# Altium project USB-SMB-ISO-CP2112.PrjPcb (part 1 of 2)
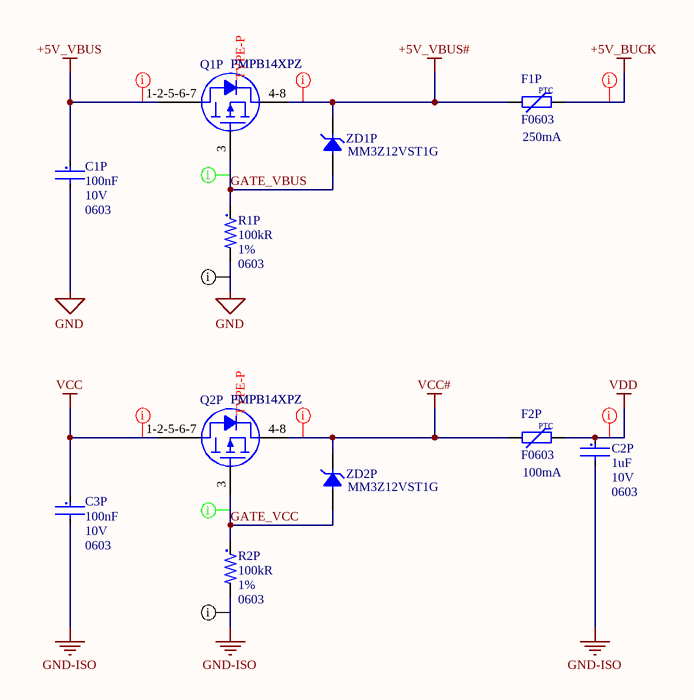
[diagram p0: 1_Power_Path.SchDoc]
6 sheets, 48 parts. Net scope: flat (ports and power ports of the same name join across sheets).
Board file: USB-SMB-ISO-CP2112-V-1.PcbDoc
Sheets:
  1_Power_Path.SchDoc
  2_LDO.SchDoc
  3_USB_TO_UART.SchDoc
  4_Digital_Isolator.SchDoc
  6_Connector.SchDoc
  7_MountingHoles.SchDoc

## Sheet 1_Power_Path.SchDoc: Power_Path
size A4; ApprovedBy: Alcatraz; CheckedBy: Alcatraz; Author: Alcatraz; CompanyName: DHNLAB; DrawnBy: Alcatraz; Engineer: Alcatraz; Organization: DHNLAB PVT LTD; Address1: DHANBAD; Address2: JHARKHAND; Address3: INDIA; Address4: ASIA; DocumentNumber: 1; Revision: 1.0; SheetNumber: 1; SheetTotal: 6; ProjectTitle: USB-SMB-ISO-CP2112

### Parts
C1P  value 100nF  Voltage: 10V  Case/Package: 0603  [C0603-IPC_C_No_Silk]  (hidden comment: C0603C104K8RACTU)
C2P  value 1uF  Voltage Rating: 10V  Case Code (Imperial): 0603  [C0603-IPC_C_No_Silk]  (hidden comment: C0603C105K8PACTU)
C3P  value 100nF  Voltage: 10V  Case/Package: 0603  [C0603-IPC_C_No_Silk]  (hidden comment: C0603C104K8RACTU)
F1P  F0603  value 250mA  [R0603-MFG]
F2P  F0603  value 100mA  [R0603-MFG]
Q1P  PMPB14XPZ  [DFN2020MD-MFG]
Q2P  PMPB14XPZ  [DFN2020MD-MFG]
R1P  value 100kR  Tolerance: 1%  Case/Package: 0603  [R0603-MFG]  (hidden comment: AC0603FR-07100KL)
R2P  value 100kR  Tolerance: 1%  Case/Package: 0603  [R0603-MFG]  (hidden comment: AC0603FR-07100KL)
ZD1P  MM3Z12VST1G  [SOD-323]
ZD2P  MM3Z12VST1G  [SOD-323]

### Nets
+5V_BUCK: F1P.2
+5V_VBUS: C1P.1 Q1P.1-2-5-6-7(D)
+5V_VBUS#: F1P.1 Q1P.4-8(S) ZD1P.1(C)
GND: C1P.2 R1P.2
GND-ISO: C2P.2 C3P.2 R2P.2
VCC: C3P.1 Q2P.1-2-5-6-7(D)
VCC#: F2P.1 Q2P.4-8(S) ZD2P.1(C)
VDD: C2P.1 F2P.2
GATE_VBUS: Q1P.3(G) R1P.1 ZD1P.2(A)
GATE_VCC: Q2P.3(G) R2P.1 ZD2P.2(A)

### Layout directives
net class Power; net class PowerRails_LowVoltage_DC: +5V_BUCK, +5V_VBUS, +5V_VBUS#, VCC, VCC#, VDD
net class GND; net class PowerRails_GND: GND, GND-ISO
net class Digital_Signal_Low_Speed; net class Signal: GATE_VBUS, GATE_VCC

### Notes on the sheet
- Title:
- Author:
- Approved:
- Size:
- Date:
- Git Hash:
- A4
- Prj:
- SW Version:
- Variant:
- Edited:
- PUBLIC
- File:
- (in symbol FUSE_PPTC_0603) PTC
- (in symbol PMPB14XPZ) TYPE-P

### Library data of the parts
C1P C3P = 100nF_10V: Multilayer Ceramic Capacitor, 0.1 uF, 10 V, ± 10%, X7R, 0603 [1608 Metric]; Manufacturer: KEMET; Material: 4241ConductorMaterial; Dissipation Factor: 5%; Temperature Coefficient: 30ppm/°C; Manufacturer Part Number: C0603C104K8RACTU; Supplier 1: Mouser; Category: Ceramic Capacitors; Stock 1: 246409; Pricing 1: 1=0.11, 10=0.075, 50=0.075, 100=0.036, 1000=0.021, 10000=0.017 (USD); Supplier Part Number 1: 80-C0603C104K8R; RoHS: Yes; Mounting Technology: Surface Mount,PCB; Pins: 2; Case Code (Imperial): 0603; Case Code (Metric): 1608; Dielectric Material: Ceramic; Min Operating Temperature: -55°C; Max Operating Temperature: 125°C; Tolerance: 10%; Voltage Rating: 10V; Packaging: Tape and Reel; Dielectric: X7R; Series: C; Package Quantity: 1; Termination: SMD/SMT; Construction: Flat; Length: 1.6mm; Width: 0.031inch; Height: 0.8mm; Thickness: 0.034inch; Lead Pitch: 0.7mm; Depth: 0.8mm; Radiation Hardening: No; Reach SVHC Compliant: No; RoHS Compliant: Yes; Lead Free: 5697LeadFree; ComponentLink1URL: https://datasheet.ciiva.com/6093/1776114-6093269.pdf?src-supplier=Farnell; ComponentLink1Description: https://datasheet.ciiva.com/6093/1776114-6093269.pdf?src-supplier=Farnell; ComponentLink2URL: https://datasheet.ciiva.com/7823/kem-c1002-x7r-smd-7823989.pdf?src-supplier=Element14; ComponentLink2Description: https://datasheet.ciiva.com/7823/kem-c1002-x7r-smd-7823989.pdf?src-supplier=Element14; ComponentLink3URL: https://datasheet.ciiva.com/22693/1851736-22693967.pdf?src-supplier=Element14; ComponentLink3Description: https://datasheet.ciiva.com/22693/1851736-22693967.pdf?src-supplier=Element14; ComponentLink4URL: https://datasheet.ciiva.com/14589/70095383-14589402.pdf?src-supplier=Allied+Electronics; ComponentLink4Description: https://datasheet.ciiva.com/14589/70095383-14589402.pdf?src-supplier=Allied+Electronics; ComponentLink5URL: https://datasheet.ciiva.com/14593/70095383-14593978.pdf?src-supplier=Allied+Electronics; ComponentLink5Description: https://datasheet.ciiva.com/14593/70095383-14593978.pdf?src-supplier=Allied+Electronics; ComponentLink6URL: https://datasheet.ciiva.com/5419/kem-c1002-x7r-smd-357932-5419657.pdf?src-supplier=Mouser; ComponentLink6Description: https://datasheet.ciiva.com/5419/kem-c1002-x7r-smd-357932-5419657.pdf?src-supplier=Mouser; ComponentLink7URL: https://datasheet.ciiva.com/18192/getdatasheetpartid-91529-18192711.pdf?src-supplier=Verical; ComponentLink7Description: https://datasheet.ciiva.com/18192/getdatasheetpartid-91529-18192711.pdf?src-supplier=Verical; Voltage Rating (DC): 10V
C2P = 1uF_10V: Ceramic Capacitor, Multilayer, Ceramic, 10V, 10% +Tol, 10% -Tol, X5R, 15% TC, 1uF, 0603; Manufacturer: KEMET; Supplier 1: Mouser; Manufacturer Part Number: C0603C105K8PACTU; RoHS: Yes; Category: Ceramic Capacitors; Stock 1: 221942; Pricing 1: 1=0.1, 10=0.03, 50=0.03, 100=0.018, 1000=0.014, 10000=0.009 (USD); Mounting Technology: Surface Mount; Case/Package: 0603; Pins: 2; Case Code (Metric): 1608; Dielectric Material: Ceramic; Weight: 7.1E-05oz; Min Operating Temperature: -55°C; Max Operating Temperature: 85°C; Tolerance: 10%; Packaging: Tape and Reel; Dielectric: X5R; Termination: SMD/SMT; Package Quantity: 1; Series: C; Construction: Flat; Voltage Rating (DC): 10V; Voltage: 10V; Length: 1.6mm; Width: 0.031inch; Height: 0.8mm; Depth: 0.8mm; Thickness: 0.035inch; Radiation Hardening: No; RoHS Compliant: Yes; Reach SVHC Compliant: No; Lead Free: 5697LeadFree
F1P F2P = FUSE_PPTC_0603: Fuse PPTC SMD 0603; Manufacturer: *; Manufacturer Part Number: *
Q1P Q2P = PMPB14XPZ: Manufacturer: Nexperia; Supplier 1: Element14; Supplier Part Number 1: 4177131; Manufacturer Part Number: PMPB14XPZ; RoHS: No; Stock 1: 3000
R1P R2P = 100K: SMD Chip Resistor, 100 kOhm, ± 1%, 100 mW, 0603 [1608 Metric], Thick Film, General Purpose; Manufacturer: Yageo; Power Rating: 100mW; Temperature Coefficient: 100ppm/°C; Voltage Rating: 50V; Working Voltage: 75V; Supplier 1: Future Electronics; Manufacturer Part Number: AC0603FR-07100KL; RoHS: Yes; Category: Chip SMD Resistors; Stock 1: 3790000; Pricing 1: 5000=0.0034, 25000=0.0018, 75000=0.0032, 125000=0.0017, 250000=0.0031, 750000=0.003, 2500000=0.0027 (USD); Case Code (Imperial): 0603; Case Code (Metric): 1608; Min Operating Temperature: -55°C; Max Operating Temperature: 155°C; Packaging: Tape and Reel; Series: AC; Termination: SMD/SMT; Construction: Rectangular; Length: 1.6mm; Depth: 0.8mm; RoHS Compliant: Yes; Military Standard: Not; Lead Free: 5697LeadFree; Supplier Part Number 1: 6029288; Max Power Dissipation: 100mW; Features: Moisture Resistant,Automotive AEC-Q200; Number of Terminations: 2; Technology: THICK FILM; Moisture Sensitivity Level: 1; Ratings: AEC-Q200; ComponentLink1URL: https://datasheet.ciiva.com/26862/getdatasheetpartid-715379-26862460.pdf?src-supplier=Verical; ComponentLink1Description: https://datasheet.ciiva.com/26862/getdatasheetpartid-715379-26862460.pdf?src-supplier=Verical; ComponentLink2URL: https://datasheet.ciiva.com/5562/pyu-ac-51-rohs-l-2-5562536.pdf?src-supplier=Mouser; ComponentLink2Description: https://datasheet.ciiva.com/5562/pyu-ac-51-rohs-l-2-5562536.pdf?src-supplier=Mouser
ZD1P ZD2P = MM3Z12VST1G: MM3Z12VST1G Zener Diode, 12V 2% 200 mW SMT 2-Pin SOD-323 | ON Semiconductor MM3Z12VST1G; Max Power Dissipation: 300mW; Impedance: 25R; Power Dissipation: 200mW; Max Reverse Leakage Current: 100nA; Test Current: 5mA; Forward Voltage: 900mV; Zener Current: 10mA; Supplier 1: Onlinecomponents.com; Supplier Part Number 1: MM3Z12VST1G; Manufacturer: ON Semiconductor; Manufacturer Part Number: MM3Z12VST1G; RoHS: Yes; Category: Zener Diodes; Stock 1: 60000; Pricing 1: 3000=0.0152, 6000=0.0145, 9000=0.0143, 27000=0.0137, 51000=0.0133, 102000=0.0128, 252000=0.0125, 501000=0.0123 (USD); Case/Package: SOD-323-2; Min Operating Temperature: -65°C; Max Operating Temperature: 150°C; Packaging: Tape and Reel; Package Quantity: 3000; Zener Voltage: 12V; Voltage Tolerance: 2%; Tolerance: 2%; Series: -; RoHS Compliant: Yes; ComponentLink1URL: https://datasheet.ciiva.com/30478/0900766b8127c8bd-30478408.pdf?src-supplier=Rs; ComponentLink1Description: https://datasheet.ciiva.com/30478/0900766b8127c8bd-30478408.pdf?src-supplier=Rs; ComponentLink2URL: https://datasheet.ciiva.com/16292/mm3z12vst1g-16292931.pdf?src-supplier=Future+Electronics; ComponentLink2Description: https://datasheet.ciiva.com/16292/mm3z12vst1g-16292931.pdf?src-supplier=Future+Electronics; ComponentLink3URL: https://datasheet.ciiva.com/22626/1878251-22626885.pdf?src-supplier=Element14; ComponentLink3Description: https://datasheet.ciiva.com/22626/1878251-22626885.pdf?src-supplier=Element14; Pins: 2; Material: Plastic; Working Voltage: 12V; Max Reverse Current: 100nA; Voltage Rating (DC): 12V; Power Rating: 200mW; Length: 1.8mm; Width: 1.35mm; Height: 1mm; Radiation Hardening: No; Lead Free: Lead Free; Reach SVHC Compliant: No; ComponentLink4URL: https://datasheet.ciiva.com/894/mm3z2v4st1-d-894650.pdf?src-supplier=Digikey; ComponentLink4Description: https://datasheet.ciiva.com/894/mm3z2v4st1-d-894650.pdf?src-supplier=Digikey; ComponentLink5URL: https://datasheet.ciiva.com/894/mm3z2v4st1-d-894651.pdf?src-supplier=Digikey; ComponentLink5Description: https://datasheet.ciiva.com/894/mm3z2v4st1-d-894651.pdf?src-supplier=Digikey; ComponentLink6URL: https://datasheet.ciiva.com/894/mm3z2v4st1-d-894649.pdf?src-supplier=Digikey; ComponentLink6Description: https://datasheet.ciiva.com/894/mm3z2v4st1-d-894649.pdf?src-supplier=Digikey

## Sheet 2_LDO.SchDoc: LDO
size A4; ApprovedBy: Alcatraz; CheckedBy: Alcatraz; Author: Alcatraz; CompanyName: DHNLAB; DrawnBy: Alcatraz; Engineer: Alcatraz; Organization: DHNLAB PVT LTD; Address1: DHANBAD; Address2: JHARKHAND; Address3: INDIA; Address4: ASIA; DocumentNumber: 2; Revision: 1.0; SheetNumber: 2; SheetTotal: 6; ProjectTitle: USB-SMB-ISO-CP2112
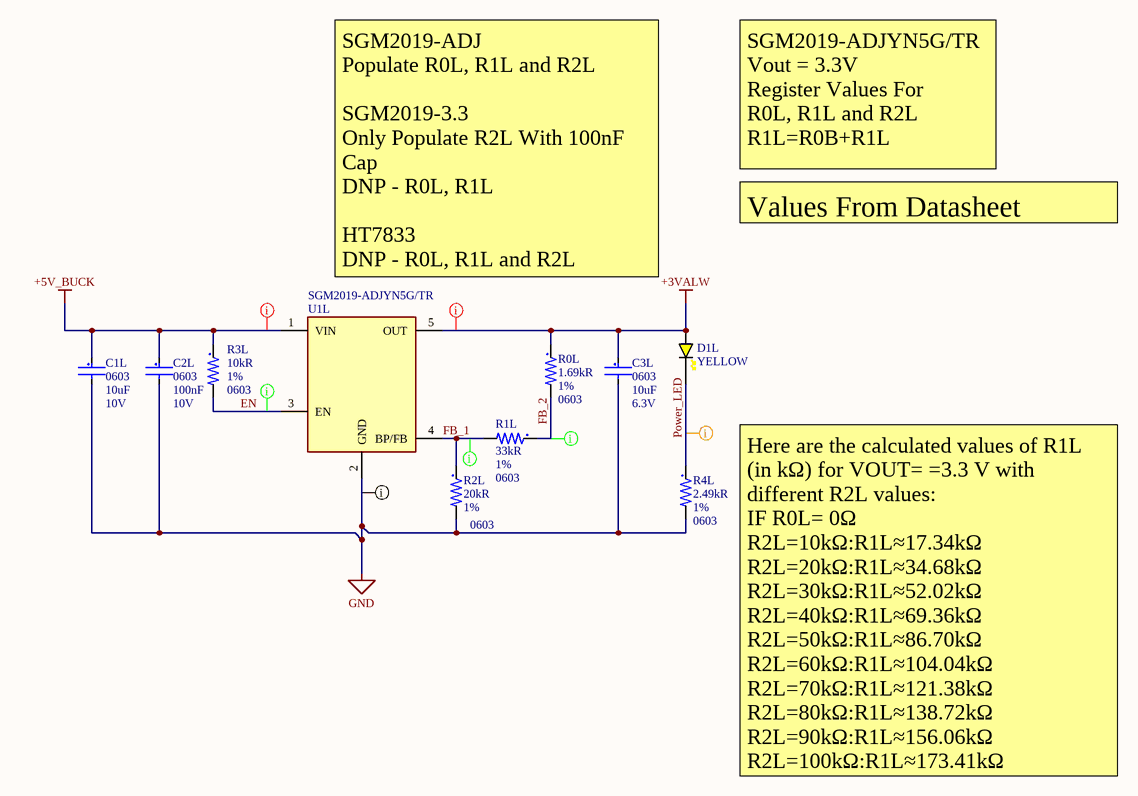
[diagram p1: 2_LDO.SchDoc]

### Parts
C1L  value 10uF  Case/Package: 0603  Voltage Rating: 10V  [C0603-IPC_C_No_Silk]  (hidden comment: C1608X5R1A106K080AC)
C2L  value 100nF  Case/Package: 0603  Voltage Rating: 10V  [C0603-IPC_C_No_Silk]  (hidden comment: C0603C104K8RACTU)
C3L  value 10uF  Case/Package: 0603  Voltage Rating: 6.3V  [C0603-IPC_C_No_Silk]  (hidden comment: CL10A106KQ8NNNC)
D1L  YELLOW  [LED_0603_YELLOW]
R0L  value 1.69kR  Tolerance: 1%  Case/Package: 0603  [R0603-MFG]  (hidden comment: MCR03EZPFX1691)
R1L  value 33kR  Tolerance: 1%  Case/Package: 0603  [R0603-MFG]  (hidden comment: ERJ-3EKF3302V)
R2L  value 20kR  Tolerance: 1%  Case/Package: 0603  [R0603-MFG]  (hidden comment: CR0603-FX-2002ELF)
R3L  value 10kR  Tolerance: 1%  Case/Package: 0603  [R0603-MFG]  (hidden comment: RC0603FR-0710KL)
R4L  value 2.49kR  Tolerance: 1%  Case/Package: 0603  [R0603-MFG]  (hidden comment: MCR03EZPFX2491)
U1L  SGM2019-ADJYN5G/TR  [TSOT-23-5-IPC-A]

### Nets
+3VALW: C3L.1 D1L.2(A) R0L.1 U1L.5(OUT)
+5V_BUCK: C1L.1 C2L.1 R3L.1 U1L.1(VIN)
GND: C1L.2 C2L.2 C3L.2 R2L.2 R4L.2 U1L.2(GND)
EN: R3L.2 U1L.3(EN)
FB_1: R1L.2 R2L.1 U1L.4(BP/FB)
FB_2: R0L.2 R1L.1
Power_LED: D1L.1(K) R4L.1

### Layout directives
net class Power; net class PowerRails_LowVoltage_DC: +3VALW, +5V_BUCK
net class GND; net class PowerRails_GND: GND
net class Power; net class PowerRails_LowVoltage_DC; net class Power_Signal: Power_LED
net class Digital_Signal_Low_Speed; net class Signal: EN, FB_1, FB_2

### Notes on the sheet
- SGM2019-ADJYN5G/TR
  Vout = 3.3V
  Register Values For
  R0L, R1L and R2L
  R1L=R0B+R1L
- Values From Datasheet
- SGM2019-ADJ
  Populate R0L, R1L and R2L
  SGM2019-3.3
  Only Populate R2L With 100nF Cap
  DNP - R0L, R1L
  HT7833
  DNP - R0L, R1L and R2L
- Here are the calculated values of R1L (in kΩ) for VOUT= =3.3 V with different R2L values:
  IF R0L= 0Ω
  R2L=10kΩ:R1L≈17.34kΩ
  R2L=20kΩ:R1L≈34.68kΩ
  R2L=30kΩ:R1L≈52.02kΩ
  R2L=40kΩ:R1L≈69.36kΩ
  R2L=50kΩ:R1L≈86.70kΩ
  R2L=60kΩ:R1L≈104.04kΩ
  R2L=70kΩ:R1L≈121.38kΩ
  R2L=80kΩ:R1L≈138.72kΩ
  R2L=90kΩ:R1L≈156.06kΩ
  R2L=100kΩ:R1L≈173.41kΩ
- Title:
- Author:
- Approved:
- Size:
- Date:
- Git Hash:
- A4
- Prj:
- SW Version:
- Variant:
- Edited:
- PUBLIC
- File:

### Library data of the parts
C1L = 10uF_10V: Multilayer Ceramic Capacitor, 10 uF, 10 V, ± 10%, X5R, 0603 [1608 Metric]; Manufacturer: TDK; Material: 4241ConductorMaterial; Supplier 1: CoreStaff; Manufacturer Part Number: C1608X5R1A106K080AC; RoHS: Yes; Category: Ceramic Capacitors; Pricing 1: 1=61.09, 10=33.6, 50=30.24, 100=24, 500=21.6, 1000=20.52, 2000=19.9, 4000=9.6 (JPY); Mounting Technology: Surface Mount; Case Code (Imperial): 0603; Case Code (Metric): 1608; Min Operating Temperature: -55°C; Max Operating Temperature: 85°C; Packaging: Tape and Reel; Dielectric: X5R; Package Quantity: 1; Series: C; Termination: SMD/SMT; Voltage Rating (DC): 10V; Length: 1.6mm; Width: 0.031inch; Height: 0.8mm; RoHS Compliant: Yes; Lead Free: Lead Free; ComponentLink1URL: https://datasheet.ciiva.com/23802/1796654-23802763.pdf?src-supplier=Newark; ComponentLink1Description: https://datasheet.ciiva.com/23802/1796654-23802763.pdf?src-supplier=Newark; Supplier Part Number 1: ST47794328; Tolerance: 10%; Stock 1: 1640; Weight: 7.1E-05oz; Thickness: 0.035inch; Reach SVHC Compliant: No; Pins: 2; Dielectric Material: Ceramic; Voltage: 10V; Construction: Flat; Depth: 0.8mm; ComponentLink2URL: https://datasheet.ciiva.com/7975/1796654-7975065.pdf?src-supplier=Element14; ComponentLink2Description: https://datasheet.ciiva.com/7975/1796654-7975065.pdf?src-supplier=Element14; ComponentLink3URL: https://datasheet.ciiva.com/22694/1796654-22694118.pdf?src-supplier=Element14; ComponentLink3Description: https://datasheet.ciiva.com/22694/1796654-22694118.pdf?src-supplier=Element14; ComponentLink4URL: https://datasheet.ciiva.com/28577/mlcc-commercial-general-en-28577085.pdf?src-supplier=Element14; ComponentLink4Description: https://datasheet.ciiva.com/28577/mlcc-commercial-general-en-28577085.pdf?src-supplier=Element14; ComponentLink5URL: https://datasheet.ciiva.com/28577/1744655-28577071.pdf?src-supplier=Element14; ComponentLink5Description: https://datasheet.ciiva.com/28577/1744655-28577071.pdf?src-supplier=Element14; ComponentLink6URL: https://datasheet.ciiva.com/6288/tdkmlcccaprange-6288222.pdf?src-supplier=Digikey; ComponentLink6Description: https://datasheet.ciiva.com/6288/tdkmlcccaprange-6288222.pdf?src-supplier=Digikey; ComponentLink7URL: https://datasheet.ciiva.com/6288/tdkmlcccaprange-6288220.pdf?src-supplier=Digikey; ComponentLink7Description: https://datasheet.ciiva.com/6288/tdkmlcccaprange-6288220.pdf?src-supplier=Digikey; ComponentLink8URL: https://datasheet.ciiva.com/6288/tdkmlcccaprange-6288223.pdf?src-supplier=Digikey; ComponentLink8Description: https://datasheet.ciiva.com/6288/tdkmlcccaprange-6288223.pdf?src-supplier=Digikey; ComponentLink9URL: https://datasheet.ciiva.com/16449/mlcc-commercial-general-en-16449573.pdf?src-supplier=Future+Electronics; ComponentLink9Description: https://datasheet.ciiva.com/16449/mlcc-commercial-general-en-16449573.pdf?src-supplier=Future+Electronics; ComponentLink10URL: https://datasheet.ciiva.com/48671/e412-c-48671301.pdf?src-supplier=Avnet; ComponentLink10Description: https://datasheet.ciiva.com/48671/e412-c-48671301.pdf?src-supplier=Avnet
C2L = 100nF_10V: as C1P on sheet 1_Power_Path; Supplier 1: Mouser; Manufacturer Part Number: C0603C104K8RACTU; RoHS: Yes; Category: Ceramic Capacitors; Pricing 1: 1=0.11, 10=0.075, 50=0.075, 100=0.036, 1000=0.021, 10000=0.017 (USD); Mounting Technology: Surface Mount,PCB; Case Code (Imperial): 0603; Case Code (Metric): 1608; Min Operating Temperature: -55°C; Max Operating Temperature: 125°C; Packaging: Tape and Reel; Dielectric: X7R; Package Quantity: 1; Series: C; Termination: SMD/SMT; Voltage Rating (DC): 10V; Length: 1.6mm; Width: 0.031inch; Height: 0.8mm; RoHS Compliant: Yes; Lead Free: 5697LeadFree; ComponentLink1URL: https://datasheet.ciiva.com/6093/1776114-6093269.pdf?src-supplier=Farnell; ComponentLink1Description: https://datasheet.ciiva.com/6093/1776114-6093269.pdf?src-supplier=Farnell; Supplier Part Number 1: 80-C0603C104K8R; Tolerance: 10%; Stock 1: 246409; Thickness: 0.034inch; Reach SVHC Compliant: No; Pins: 2; Dielectric Material: Ceramic; Voltage: 10V; Construction: Flat; Depth: 0.8mm; ComponentLink2URL: https://datasheet.ciiva.com/7823/kem-c1002-x7r-smd-7823989.pdf?src-supplier=Element14; ComponentLink2Description: https://datasheet.ciiva.com/7823/kem-c1002-x7r-smd-7823989.pdf?src-supplier=Element14; ComponentLink3URL: https://datasheet.ciiva.com/22693/1851736-22693967.pdf?src-supplier=Element14; ComponentLink3Description: https://datasheet.ciiva.com/22693/1851736-22693967.pdf?src-supplier=Element14; ComponentLink4URL: https://datasheet.ciiva.com/14589/70095383-14589402.pdf?src-supplier=Allied+Electronics; ComponentLink4Description: https://datasheet.ciiva.com/14589/70095383-14589402.pdf?src-supplier=Allied+Electronics; ComponentLink5URL: https://datasheet.ciiva.com/14593/70095383-14593978.pdf?src-supplier=Allied+Electronics; ComponentLink5Description: https://datasheet.ciiva.com/14593/70095383-14593978.pdf?src-supplier=Allied+Electronics; ComponentLink6URL: https://datasheet.ciiva.com/5419/kem-c1002-x7r-smd-357932-5419657.pdf?src-supplier=Mouser; ComponentLink6Description: https://datasheet.ciiva.com/5419/kem-c1002-x7r-smd-357932-5419657.pdf?src-supplier=Mouser; ComponentLink7URL: https://datasheet.ciiva.com/18192/getdatasheetpartid-91529-18192711.pdf?src-supplier=Verical; ComponentLink7Description: https://datasheet.ciiva.com/18192/getdatasheetpartid-91529-18192711.pdf?src-supplier=Verical; Lead Pitch: 0.7mm; Radiation Hardening: No
C3L = 10uF_6.3V: Multilayer Ceramic Capacitor, 10 uF, 6.3 V, ± 10%, X5R, 0603 [1608 Metric]; Manufacturer: Samsung; Supplier 1: Avnet; Manufacturer Part Number: CL10A106KQ8NNNC; RoHS: Yes; Category: Ceramic Capacitors; Stock 1: 304000; Pricing 1: 4000=0.01211, 8000=0.01183, 16000=0.01155, 24000=0.01128, 32000=0.011 (USD); Mounting Technology: Surface Mount; Case Code (Imperial): 0603; Case Code (Metric): 1608; Material: Ceramic; Min Operating Temperature: -55°C; Max Operating Temperature: 85°C; Tolerance: 10%; Voltage Rating (DC): 6.3V; Series: CL; Packaging: Tape and Reel; Dielectric: X5R; Length: 1.6mm; Width: 0.031inch; Height: 0.8mm; Thickness: 0.035inch; RoHS Compliant: Yes; ComponentLink1URL: https://datasheet.ciiva.com/25793/cl10a106kq8nnnc-25793136.pdf?src-supplier=Digikey; ComponentLink1Description: https://datasheet.ciiva.com/25793/cl10a106kq8nnnc-25793136.pdf?src-supplier=Digikey; ComponentLink2URL: https://datasheet.ciiva.com/26838/getdatasheetpartid-359689-26838341.pdf?src-supplier=Verical; ComponentLink2Description: https://datasheet.ciiva.com/26838/getdatasheetpartid-359689-26838341.pdf?src-supplier=Verical; Supplier Part Number 1: CL10A106KQ8NNNC; Package Quantity: 1; ComponentLink3URL: https://datasheet.ciiva.com/29198/457384-da-01-en-vs-kondensator-0603-29198793.pdf?src-supplier=Conrad; ComponentLink3Description: https://datasheet.ciiva.com/29198/457384-da-01-en-vs-kondensator-0603-29198793.pdf?src-supplier=Conrad; Construction: Flat; Voltage: 6.3V; Depth: 0.8mm; Radiation Hardening: No
D1L = LED_0603_YELLOW: LED 0603 YELLOW SMD
R0L = 1.69K: Surface Mount Thick Film Chip Resistor 0603 Case 1.69K Ohms 1% Tolerance 100 PPM; Manufacturer: Rohm; Power Rating: 100mW; Temperature Coefficient: 100ppm/°C; Voltage Rating (DC): 50V; Supplier 1: Quest; Manufacturer Part Number: MCR03EZPFX1691; RoHS: Yes; Category: Chip SMD Resistors; Stock 1: 11347; Pricing 1: 1=0.0232, 217=0.0145, 1380=0.0087, 5748=0.0044 (USD); Case Code (Imperial): 0603; Case Code (Metric): 1608; Min Operating Temperature: -55°C; Max Operating Temperature: 155°C; Packaging: Cut Tape; Number of Terminations: 2; Max Power Dissipation: 100mW; Features: Automotive AEC-Q200; Series: MCR03; Lead Free: Lead Free; RoHS Compliant: Yes; Supplier Part Number 1: MCR03EZPFX1691; Package Quantity: 1; Length: 0.063inch; Width: 0.031inch; Height: 0.022inch; Mounting Technology: Surface Mount; ComponentLink1URL: http://rohmfs.rohm.com/en/products/databook/datasheet/passive/resistor/chip_resistor/mcr.pdf?src-supplier=Avnet; ComponentLink1Description: http://rohmfs.rohm.com/en/products/databook/datasheet/passive/resistor/chip_resistor/mcr.pdf?src-supplier=Avnet; ComponentLink2URL: http://www.rohm.com/web/global/datasheet/MCR03EZPFX/mcr-e?src-supplier=Digikey; ComponentLink2Description: http://www.rohm.com/web/global/datasheet/MCR03EZPFX/mcr-e?src-supplier=Digikey
R1L = 33K: Res Thick Film 0603 33K Ohm 1% 0.1W(1/10W) ±100ppm/C Pad SMD Automotive T/R; Manufacturer: Panasonic; Power Rating: 100mW; Temperature Coefficient: 100ppm/°C; Voltage Rating (DC): 75V; Supplier 1: Onlinecomponents.com; Manufacturer Part Number: ERJ-3EKF3302V; RoHS: Yes; Category: Chip SMD Resistors; Stock 1: 350000; Pricing 1: 5000=0.0041, 10000=0.0039, 20000=0.0037, 40000=0.0036, 50000=0.0035 (USD); Case Code (Imperial): 0603; Case Code (Metric): 1608; Min Operating Temperature: -55°C; Max Operating Temperature: 155°C; Packaging: Tape and Reel; Number of Terminations: 2; Max Power Dissipation: 100mW; Features: Automotive AEC-Q200; Series: ERJ; Lead Free: 5697LeadFree; RoHS Compliant: Yes; Supplier Part Number 1: ERJ3EKF3302V; Mounting Technology: Surface Mount; Contact Plating: Tin; Package Quantity: 1; Length: 1.6mm; Width: 0.8mm; Height: 0.022inch; Pins: 2; Voltage Rating: 75V; Termination: SMD/SMT; Construction: Rectangular; Resistor Type: Thick Film; Resistance Tolerance: 1%; Depth: 0.8mm; Radiation Hardening: No; Military Standard: Not; Reach SVHC Compliant: No
R2L = 20K: SMD Chip Resistor, 20 kOhm, ± 1%, 100 mW, 0603 [1608 Metric], Thick Film, General Purpose; Manufacturer: Bourns; Power Rating: 100mW; Temperature Coefficient: 100ppm/°C; Voltage Rating (DC): 50V; Supplier 1: Onlinecomponents.com; Manufacturer Part Number: CR0603-FX-2002ELF; RoHS: Yes; Category: Chip SMD Resistors; Stock 1: 20000; Pricing 1: 20000=0.0014, 40000=0.0013, 80000=0.0013, 160000=0.0012 (USD); Case Code (Imperial): 0603; Case Code (Metric): 1608; Min Operating Temperature: -55°C; Max Operating Temperature: 155°C; Packaging: Tape and Reel; Number of Terminations: 2; Max Power Dissipation: 100mW; Features: Moisture Resistant; Series: CR0603; RoHS Compliant: Yes; ComponentLink1URL: https://datasheet.ciiva.com/11809/0900766b80fcdb72-11809666.pdf?src-supplier=Rs; ComponentLink1Description: https://datasheet.ciiva.com/11809/0900766b80fcdb72-11809666.pdf?src-supplier=Rs; ComponentLink2URL: https://datasheet.ciiva.com/9121/chpreztr-9121928.pdf?src-supplier=Avnet; ComponentLink2Description: https://datasheet.ciiva.com/9121/chpreztr-9121928.pdf?src-supplier=Avnet; Supplier Part Number 1: CR0603-FX-2002ELF; Mounting Technology: Surface Mount; Contact Plating: Tin; Package Quantity: 1; Length: 1.6mm; Width: 0.8mm; Height: 0.45mm; Voltage Rating: 50V; Resistor Type: Thick Film; Termination: SMD/SMT; Resistance Tolerance: 1%; Technology: THICK FILM; Depth: 0.8mm; Thickness: 457um; Radiation Hardening: No; Reach SVHC Compliant: No
R3L = 10K: SMD Chip Resistor, 10 kOhm, ± 1%, 100 mW, 0603 [1608 Metric], Thick Film, General Purpose; Manufacturer: Yageo; Power Rating: 100mW; Temperature Coefficient: 100ppm/°C; Voltage Rating (DC): 50V; Voltage Rating: 75V; Supplier 1: Future Electronics; Manufacturer Part Number: RC0603FR-0710KL; RoHS: Yes; Category: Chip SMD Resistors; Stock 1: 44660000; Pricing 1: 5000=0.0015, 50000=0.0014, 150000=0.0014, 375000=0.0013, 1000000=0.0012 (USD); Case Code (Imperial): 0603; Case Code (Metric): 1608; Min Operating Temperature: -55°C; Max Operating Temperature: 155°C; Packaging: Tape and Reel; Number of Terminations: 2; Max Power Dissipation: 100mW; Features: Moisture Resistant; Series: RC; Lead Free: 5697LeadFree; RoHS Compliant: Yes; Supplier Part Number 1: 4023214; Length: 1.6mm; Width: 0.8mm; Height: 0.45mm; Pins: 2; Weight: 7.1E-05oz; Resistance Tolerance: 1%; Termination: SMD/SMT; Resistor Type: Thick Film; Construction: Rectangular; Depth: 0.8mm; Lead Pitch: 0.3mm; Reach SVHC Compliant: No; Military Standard: Not
R4L = 2.49K: Res Thick Film 0603 2.49K Ohm 1% 1/10W ±100ppm/°C Molded SMD SMD Paper T/R; Manufacturer: Rohm; Power Rating: 100mW; Voltage Rating (DC): 50V; Supplier 1: One Stop Electro; Manufacturer Part Number: MCR03EZPFX2491; RoHS: Yes; Category: Chip SMD Resistors; Stock 1: 683; Pricing 1: 1=0.036, 10=0.031, 100=0.031, 1000=0.028 (USD); Case Code (Imperial): 0603; Case Code (Metric): 1608; Min Operating Temperature: -55°C; Max Operating Temperature: 155°C; Packaging: Cut Tape; Number of Terminations: 2; Temperature Coefficient: 100ppm/°C; Max Power Dissipation: 100mW; Features: Automotive AEC-Q200; Series: MCR03; Lead Free: Lead Free; RoHS Compliant: Yes; ComponentLink1URL: https://datasheet.ciiva.com/2520/mcr-2520347.pdf?src-supplier=Digikey; ComponentLink1Description: https://datasheet.ciiva.com/2520/mcr-2520347.pdf?src-supplier=Digikey; ComponentLink2URL: https://datasheet.ciiva.com/2520/mcr-2520348.pdf?src-supplier=Digikey; ComponentLink2Description: https://datasheet.ciiva.com/2520/mcr-2520348.pdf?src-supplier=Digikey; ComponentLink3URL: https://datasheet.ciiva.com/2520/mcr-2520349.pdf?src-supplier=Digikey; ComponentLink3Description: https://datasheet.ciiva.com/2520/mcr-2520349.pdf?src-supplier=Digikey; ComponentLink4URL: https://datasheet.ciiva.com/16203/mcr03ezpd-16203167.pdf?src-supplier=Future+Electronics; ComponentLink4Description: https://datasheet.ciiva.com/16203/mcr03ezpd-16203167.pdf?src-supplier=Future+Electronics; Supplier Part Number 1: 53268691; Mounting Technology: Surface Mount; Contact Plating: Tin; Package Quantity: 1; Length: 0.063inch; Width: 0.031inch; Height: 0.022inch
U1L = SGM2019-ADJYN5G/TR: LDO U-Reg Adj 0, 3A SOT23-5; Manufacturer: SG Micro; Supplier 1: Sourcengine; Supplier Part Number 1: SGM2019-ADJYN5GTR-112944978; Manufacturer Part Number: SGM2019-ADJYN5G/TR; RoHS: No; Category: LDO; Stock 1: 6915

## Sheet 3_USB_TO_UART.SchDoc: USB_TO_UART
size A4; ApprovedBy: Alcatraz; CheckedBy: Alcatraz; Author: Alcatraz; CompanyName: DHNLAB; DrawnBy: Alcatraz; Engineer: Alcatraz; Organization: DHNLAB PVT LTD; Address1: DHANBAD; Address2: JHARKHAND; Address3: INDIA; Address4: ASIA; DocumentNumber: 3; Revision: 1.0; SheetNumber: 3; SheetTotal: 6; ProjectTitle: USB-SMB-ISO-CP2112
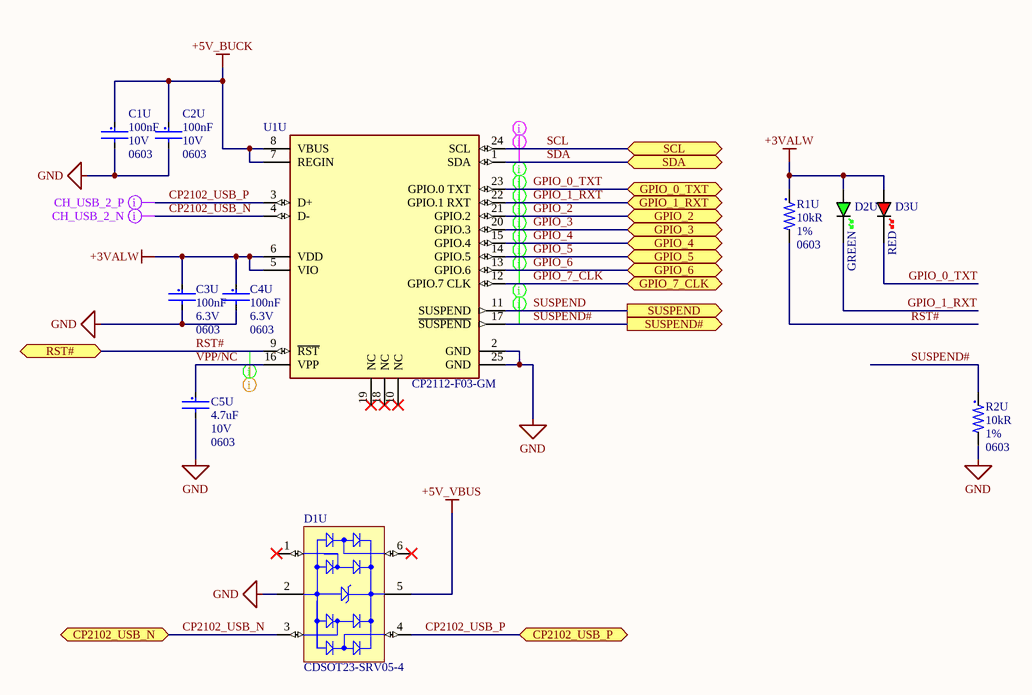
[diagram p2: 3_USB_TO_UART.SchDoc]

### Parts
C1U  value 100nF  Voltage Rating (DC): 10V  Case/Package: 0603  [C0603-IPC_C_No_Silk]  (hidden comment: C0603C104K8RACTU)
C2U  value 100nF  Voltage Rating (DC): 10V  Case/Package: 0603  [C0603-IPC_C_No_Silk]  (hidden comment: C0603C104K8RACTU)
C3U  value 100nF  Voltage: 6.3V  Package: 0603  [C0603-IPC_C_No_Silk]  (hidden comment: KGM15AR70J104KM)
C4U  value 100nF  Voltage: 6.3V  Package: 0603  [C0603-IPC_C_No_Silk]  (hidden comment: KGM15AR70J104KM)
C5U  value 4.7uF  Voltage Rating (DC): 10V  Case/Package: 0603  [C0603-MFG_No_Silk]  (hidden comment: CL10A475KP8NNNC)
D1U  CDSOT23-SRV05-4  [SOT23-6-IPC_C]
D2U  GREEN  [LED_0603_GREEN]
D3U  RED  [LED_0603_RED]
R1U  value 10kR  Tolerance: 1%  Case/Package: 0603  [R0603-MFG]  (hidden comment: RC0603FR-0710KL)
R2U  value 10kR  Tolerance: 1%  Case/Package: 0603  [R0603-MFG]  (hidden comment: RC0603FR-0710KL)
U1U  CP2112-F03-GM  [CP2112-IPC_A]

### Ports
CP2102_USB_N (bidir), CP2102_USB_P (bidir), GPIO_0_TXT (bidir), GPIO_1_RXT (bidir), GPIO_2 (bidir), GPIO_3 (bidir), GPIO_4 (bidir), GPIO_5 (bidir), GPIO_6 (bidir), GPIO_7_CLK (bidir), RST# (bidir), SCL (bidir), SDA (bidir), SUSPEND (out), SUSPEND# (out)

### Nets
+3VALW: C3U.1 C4U.1 D2U.2(A) D3U.2(A) R1U.1 U1U.5(VIO) U1U.6(VDD)
+5V_BUCK: C1U.1 C2U.1 U1U.7(REGIN) U1U.8(VBUS)
+5V_VBUS: D1U.5(VBUS)
GND: C1U.2 C2U.2 C3U.2 C4U.2 C5U.2 D1U.2(GND) R2U.2 U1U.2(GND) U1U.25(GND)
CP2102_USB_N: D1U.3(I/O_2) U1U.4(D-) ; port CP2102_USB_N
CP2102_USB_P: D1U.4(I/O_3) U1U.3(D+) ; port CP2102_USB_P
GPIO_0_TXT: D3U.1(K) U1U.23(GPIO.0_TXT) ; port GPIO_0_TXT
GPIO_1_RXT: D2U.1(K) U1U.22(GPIO.1_RXT) ; port GPIO_1_RXT
GPIO_2: U1U.21(GPIO.2) ; port GPIO_2
GPIO_3: U1U.20(GPIO.3) ; port GPIO_3
GPIO_4: U1U.15(GPIO.4) ; port GPIO_4
GPIO_5: U1U.14(GPIO.5) ; port GPIO_5
GPIO_6: U1U.13(GPIO.6) ; port GPIO_6
GPIO_7_CLK: U1U.12(GPIO.7_CLK) ; port GPIO_7_CLK
RST#: R1U.2 U1U.9(~{RST}) ; port RST#
SCL: U1U.24(SCL) ; port SCL
SDA: U1U.1(SDA) ; port SDA
SUSPEND: U1U.11(SUSPEND) ; port SUSPEND
SUSPEND#: R2U.1 U1U.17(~{SUSPEND}) ; port SUSPEND#
VPP/NC: C5U.1 U1U.16(VPP)

Not connected (* = marked no-connect by the designer): D1U 1(I/O_1)* 6(I/O_4)*; U1U 10(NC)* 18(NC)* 19(NC)*

### Layout directives
net class Signal_50_ohm; net class Digital_Signal_Low_Speed: SCL, SDA
differential pair; differential pair class USB_DATA: CP2102_USB_N, CP2102_USB_P
net class Power; net class PowerRails_LowVoltage_DC; net class Power_Signal: VPP/NC
net class Digital_Signal_Low_Speed; net class Signal: GPIO_0_TXT, GPIO_1_RXT, GPIO_2, GPIO_3, GPIO_4, GPIO_5, GPIO_6, GPIO_7_CLK, RST#, SUSPEND, SUSPEND#

### Notes on the sheet
- Title:
- Author:
- Approved:
- Size:
- Date:
- Git Hash:
- A4
- Prj:
- SW Version:
- Variant:
- Edited:
- PUBLIC
- File:

### Library data of the parts
C1U C2U = 100nF_10V: as C1P on sheet 1_Power_Path; Supplier 1: Mouser; Supplier Part Number 1: 80-C0603C104K8R; Manufacturer Part Number: C0603C104K8RACTU; RoHS: Yes; Category: Ceramic Capacitors; Stock 1: 246409; Pricing 1: 1=0.11, 10=0.075, 50=0.075, 100=0.036, 1000=0.021, 10000=0.017 (USD); Mounting Technology: Surface Mount,PCB; Pins: 2; Case Code (Metric): 1608; Case Code (Imperial): 0603; Min Operating Temperature: -55°C; Max Operating Temperature: 125°C; Tolerance: 10%; Packaging: Tape and Reel; Voltage Rating: 10V; Series: C; Dielectric: X7R; Package Quantity: 1; Termination: SMD/SMT; Length: 1.6mm; Width: 0.031inch; Height: 0.8mm; Depth: 0.8mm; Thickness: 0.034inch; Radiation Hardening: No; RoHS Compliant: Yes; ComponentLink1URL: https://datasheet.ciiva.com/6093/1776114-6093269.pdf?src-supplier=Farnell; ComponentLink1Description: https://datasheet.ciiva.com/6093/1776114-6093269.pdf?src-supplier=Farnell; Dielectric Material: Ceramic; Lead Pitch: 0.7mm; Voltage: 10V; Construction: Flat; Reach SVHC Compliant: No; Lead Free: 5697LeadFree; ComponentLink2URL: https://datasheet.ciiva.com/7823/kem-c1002-x7r-smd-7823989.pdf?src-supplier=Element14; ComponentLink2Description: https://datasheet.ciiva.com/7823/kem-c1002-x7r-smd-7823989.pdf?src-supplier=Element14; ComponentLink3URL: https://datasheet.ciiva.com/22693/1851736-22693967.pdf?src-supplier=Element14; ComponentLink3Description: https://datasheet.ciiva.com/22693/1851736-22693967.pdf?src-supplier=Element14; ComponentLink4URL: https://datasheet.ciiva.com/14589/70095383-14589402.pdf?src-supplier=Allied+Electronics; ComponentLink4Description: https://datasheet.ciiva.com/14589/70095383-14589402.pdf?src-supplier=Allied+Electronics; ComponentLink5URL: https://datasheet.ciiva.com/14593/70095383-14593978.pdf?src-supplier=Allied+Electronics; ComponentLink5Description: https://datasheet.ciiva.com/14593/70095383-14593978.pdf?src-supplier=Allied+Electronics; ComponentLink6URL: https://datasheet.ciiva.com/5419/kem-c1002-x7r-smd-357932-5419657.pdf?src-supplier=Mouser; ComponentLink6Description: https://datasheet.ciiva.com/5419/kem-c1002-x7r-smd-357932-5419657.pdf?src-supplier=Mouser; ComponentLink7URL: https://datasheet.ciiva.com/18192/getdatasheetpartid-91529-18192711.pdf?src-supplier=Verical; ComponentLink7Description: https://datasheet.ciiva.com/18192/getdatasheetpartid-91529-18192711.pdf?src-supplier=Verical
C3U C4U = 100nF_6.3V: Cap Cer 0.1UF 6.3V X7R 0603; Manufacturer: KYOCERA AVX; Tol: 10%; Supplier 1: Digikey; Supplier Part Number 1: 478-KGM15AR70J104KMCT-ND; Manufacturer Part Number: KGM15AR70J104KM; Category: Ceramic Capacitors; Stock 1: 117167; Pricing 1: 1=0.1, 10=0.032, 50=0.0186, 100=0.0144, 500=0.01082, 1000=0.0085, 2500=0.00772, 5000=0.00711 (USD)
C5U = 4.7uF_10V: Multilayer Ceramic Capacitor, 4.7 uF, 10 V, ± 10%, X5R, 0603 [1608 Metric]; Manufacturer: Samsung; Supplier 1: Verical; Supplier Part Number 1: CL10A475KP8NNNC; Manufacturer Part Number: CL10A475KP8NNNC; RoHS: Yes; Category: Ceramic Capacitors; Stock 1: 412000; Pricing 1: 4000=0.0042 (USD); Mounting Technology: Surface Mount; Case Code (Metric): 1608; Case Code (Imperial): 0603; Min Operating Temperature: -55°C; Max Operating Temperature: 85°C; Tolerance: 10%; Packaging: Tape and Reel; Voltage Rating: 10V; Series: CL; Dielectric: X5R; Package Quantity: 1; Length: 1.6mm; Width: 0.031inch; Height: 0.8mm; Depth: 0.8mm; Thickness: 0.035inch; Radiation Hardening: No; RoHS Compliant: Yes; Construction: Flat
D1U = SRV05-4: TVS DIODE 5V 15V SOT23-6; Manufacturer: Bourns Inc.; Direction: Bidirectional; Number Of Channels: 4; Breakdown Voltage: 6V; Peak Pulse Current: 30A; Standoff Height: 0.2mm; Peak Pulse Power: 500W; Max Junction Temp: +150°C; Manufacturer Part Number: CDSOT23-SRV05-4; RoHS: TRUE; Category: Diode; Clamping Voltage: 15V; Reverse Standoff Voltage: 5V; Height: 1.45mm; Lead Free: Yes; ComponentLink2URL: https://www.bourns.com/docs/Product-Datasheets/CDSOT23-SRV05-4.pdf; ComponentLink2Description: Datasheet; Temperature Range High: +150°C; Octopart: https://octopart.com/cdsot23-srv05-4-bourns-1679449; Automotive: No; Device Class L1: Circuit Protection; Temperature: -55°C to +150°C; Device Class L2: TVS Diodes; Temperature Range Low: -55°C; Device Class L3: unset; Package: CDSOT23-SRV05-4; Ipc Land Pattern Name: SOT95P280X118-6; Mouser Description: CDSOT23-SRV05-4, Quad Uni-Directional TVS Diode, 500W, 6-Pin SOT-23; Digikey Description: TVS DIODE 5V 15V SOT23-6
D2U = LED_0603_GREEN: LED 0603 GREEN SMD
D3U = LED_0603_RED: LED 0603 RED SMD
R1U R2U = 10K: SMD Chip Resistor, 10 kOhm, ± 1%, 100 mW, 0603 [1608 Metric], Thick Film, General Purpose; Manufacturer: Yageo; Power Rating: 100mW; Temperature Coefficient: 100ppm/°C; Voltage Rating: 75V; Voltage Rating (DC): 50V; Supplier 1: Future Electronics; Manufacturer Part Number: RC0603FR-0710KL; RoHS: Yes; Category: Chip SMD Resistors; Stock 1: 44660000; Pricing 1: 5000=0.0015, 50000=0.0014, 150000=0.0014, 375000=0.0013, 1000000=0.0012 (USD); Case Code (Imperial): 0603; Case Code (Metric): 1608; Min Operating Temperature: -55°C; Max Operating Temperature: 155°C; Packaging: Tape and Reel; Series: RC; Termination: SMD/SMT; Construction: Rectangular; Length: 1.6mm; Depth: 0.8mm; RoHS Compliant: Yes; Military Standard: Not; Lead Free: 5697LeadFree; Supplier Part Number 1: 4023214; Max Power Dissipation: 100mW; Features: Moisture Resistant; Number of Terminations: 2; Pins: 2; Weight: 7.1E-05oz; Resistance Tolerance: 1%; Resistor Type: Thick Film; Width: 0.8mm; Height: 0.45mm; Lead Pitch: 0.3mm; Reach SVHC Compliant: No
U1U = CP2112-F03-GM: IC HID USB-TO-SMBUS BRIDGE 24QFN; Manufacturer: Silicon Labs; Max Junction Temp: +105°C; Interface: USB,SMBus; Max Supply Voltage: 3.6V; Nominal Supply Current: 130-1500uA; Min Supply Voltage: 1.8V; Standoff Height: 0mm; ComponentLink2URL: https://www.silabs.com/documents/public/data-sheets/cp2112-datasheet.pdf; ComponentLink2Description: Datasheet; RoHS: TRUE; Mouser Description: Single-Chip HID USB to SMBus Master Bridge 24-Pin QFN; Temperature: -40°C to +85°C; Octopart: https://octopart.com/cp2112-f03-gm-silicon+labs-81780828; Ipc Land Pattern Name: QFN50P400X400X75-24; Category: IC; Package: CP2112-F03-GM; Device Class L3: Controllers; Device Class L1: Integrated Circuits (ICs); Device Class L2: Interface ICs; Automotive: No; Temperature Range High: +85°C; Lead Free: Yes; Digikey Description: IC HID USB-TO-SMBUS BRIDGE 24QFN; Ambient Temperature Range Low: -40°C; Height: 0.8mm; Ambient Temperature Range High: +85°C; Manufacturer Part Number: CP2112-F03-GM; Temperature Range Low: -40°C

## Sheet 4_Digital_Isolator.SchDoc: Digital_Isolator
size A4; ApprovedBy: Alcatraz; CheckedBy: Alcatraz; Author: Alcatraz; CompanyName: DHNLAB; DrawnBy: Alcatraz; Engineer: Alcatraz; Organization: DHNLAB PVT LTD; Address1: DHANBAD; Address2: JHARKHAND; Address3: INDIA; Address4: ASIA; DocumentNumber: 4; Revision: 1.0; SheetNumber: 4; SheetTotal: 6; ProjectTitle: USB-SMB-ISO-CP2112
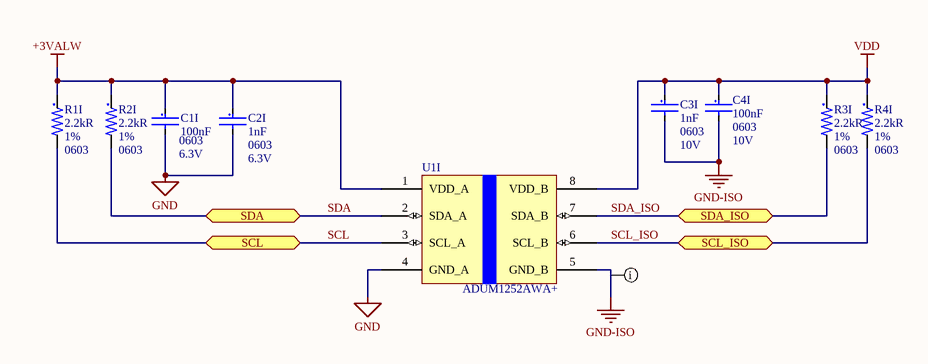
[diagram p3: 4_Digital_Isolator.SchDoc]

### Parts
C1I  value 100nF  Voltage: 6.3V  Package: 0603  [C0603-IPC_C_No_Silk]  (hidden comment: KGM15AR70J104KM)
C2I  value 1nF  Case Code (Imperial): 0603  Voltage Rating: 6.3V  [C0603-IPC_C_No_Silk]  (hidden comment: 06036A102KAT2A)
C3I  value 1nF  Case Code (Imperial): 0603  Voltage Rating: 10V  [C0603-IPC_C_No_Silk]  (hidden comment: CC0603KRX7R6BB102)
C4I  value 100nF  Voltage: 10V  Case/Package: 0603  [C0603-IPC_C_No_Silk]  (hidden comment: C0603C104K8RACTU)
R1I  value 2.2kR  Tolerance: 1%  Case/Package: 0603  [R0603-MFG]  (hidden comment: RC0603FR-072K2L)
R2I  value 2.2kR  Tolerance: 1%  Case/Package: 0603  [R0603-MFG]  (hidden comment: RC0603FR-072K2L)
R3I  value 2.2kR  Tolerance: 1%  Case/Package: 0603  [R0603-MFG]  (hidden comment: RC0603FR-072K2L)
R4I  value 2.2kR  Tolerance: 1%  Case/Package: 0603  [R0603-MFG]  (hidden comment: RC0603FR-072K2L)
U1I  ADUM1252AWA+  [SOIC-W-8-IPC_A]

### Ports
SCL (bidir), SCL_ISO (bidir), SDA (bidir), SDA_ISO (bidir)

### Nets
+3VALW: C1I.1 C2I.1 R1I.1 R2I.1 U1I.1(VDD_A)
GND: C1I.2 C2I.2 U1I.4(GND_A)
GND-ISO: C3I.2 C4I.2 U1I.5(GND_B)
VDD: C3I.1 C4I.1 R3I.1 R4I.1 U1I.8(VDD_B)
SCL: R1I.2 U1I.3(SCL_A) ; port SCL
SCL_ISO: R4I.2 U1I.6(SCL_B) ; port SCL_ISO
SDA: R2I.2 U1I.2(SDA_A) ; port SDA
SDA_ISO: R3I.2 U1I.7(SDA_B) ; port SDA_ISO

### Layout directives
net class GND; net class PowerRails_GND: GND-ISO

### Notes on the sheet
- Title:
- Author:
- Approved:
- Size:
- Date:
- Git Hash:
- A4
- Prj:
- SW Version:
- Variant:
- Edited:
- PUBLIC
- File:

### Library data of the parts
C1I = 100nF_6.3V: as C3U on sheet 3_USB_TO_UART; Supplier 1: Digikey; Manufacturer Part Number: KGM15AR70J104KM; Category: Ceramic Capacitors; Stock 1: 117167; Pricing 1: 1=0.1, 10=0.032, 50=0.0186, 100=0.0144, 500=0.01082, 1000=0.0085, 2500=0.00772, 5000=0.00711 (USD); Supplier Part Number 1: 478-KGM15AR70J104KMCT-ND
C2I = 1nF_6.3V: Cap Ceramic 0.001uF 6.3V C0G 10% SMD 0603 125°C Paper T/R; Manufacturer: Kyocera AVX; Supplier 1: Avnet; Manufacturer Part Number: 06036A102KAT2A; RoHS: Yes; Category: Ceramic Capacitors; Mounting Technology: Surface Mount; Case/Package: 0603; Pins: 2; Case Code (Metric): 1608; Min Operating Temperature: -55°C; Max Operating Temperature: 125°C; Packaging: Tape and Reel; Tolerance: 10%; Package Quantity: 4000; Voltage Rating (DC): 6.3V; Dielectric: C0G; Termination: SMD/SMT; Series: -; Construction: Flat; Length: 1.6mm; Width: 0.032inch; Depth: 0.81mm; Thickness: 0.035inch; RoHS Compliant: Yes; ComponentLink1URL: https://datasheet.ciiva.com/6265/ccog-6265066.pdf?src-supplier=Digikey; ComponentLink1Description: https://datasheet.ciiva.com/6265/ccog-6265066.pdf?src-supplier=Digikey; Supplier Part Number 1: 06036A102KAT2A
C3I = 1nF_10V: Cap Ceramic 0.001uF 10V X7R 10% SMD 0603 125°C Paper T/R; Manufacturer: Yageo; Supplier 1: Future Electronics; Manufacturer Part Number: CC0603KRX7R6BB102; RoHS: Yes; Category: Ceramic Capacitors; Mounting Technology: Surface Mount; Case/Package: 0603; Case Code (Metric): 1608; Min Operating Temperature: -55°C; Max Operating Temperature: 125°C; Packaging: Tape and Reel; Tolerance: 10%; Voltage Rating (DC): 10V; Dielectric: X7R; Termination: Wraparound; Series: CC; Construction: Flat; Length: 0.063inch; Width: 0.031inch; Thickness: 0.035inch; RoHS Compliant: Yes; ComponentLink1URL: https://datasheet.ciiva.com/13210/upy-gphc-x7r-6-3v-to-50v-8-12304-13210264.pdf?src-supplier=Mouser; ComponentLink1Description: https://datasheet.ciiva.com/13210/upy-gphc-x7r-6-3v-to-50v-8-12304-13210264.pdf?src-supplier=Mouser; Supplier Part Number 1: 6091492; Stock 1: 16000; Pricing 1: 4000=0.0036, 16000=0.0035, 80000=0.0033, 160000=0.0033, 500000=0.0031 (USD); Height: 0.8mm; Lead Free: Lead Free; Halogen Free: Halogen Free
C4I = 100nF_10V: as C1P on sheet 1_Power_Path; Supplier 1: Mouser; Manufacturer Part Number: C0603C104K8RACTU; Category: Ceramic Capacitors; Stock 1: 246409; Pricing 1: 1=0.11, 10=0.075, 50=0.075, 100=0.036, 1000=0.021, 10000=0.017 (USD); Supplier Part Number 1: 80-C0603C104K8R; RoHS: Yes; Mounting Technology: Surface Mount,PCB; Pins: 2; Case Code (Imperial): 0603; Case Code (Metric): 1608; Dielectric Material: Ceramic; Min Operating Temperature: -55°C; Max Operating Temperature: 125°C; Tolerance: 10%; Voltage Rating: 10V; Packaging: Tape and Reel; Dielectric: X7R; Series: C; Package Quantity: 1; Termination: SMD/SMT; Construction: Flat; Length: 1.6mm; Width: 0.031inch; Height: 0.8mm; Thickness: 0.034inch; Lead Pitch: 0.7mm; Depth: 0.8mm; Radiation Hardening: No; Reach SVHC Compliant: No; RoHS Compliant: Yes; Lead Free: 5697LeadFree; ComponentLink1URL: https://datasheet.ciiva.com/6093/1776114-6093269.pdf?src-supplier=Farnell; ComponentLink1Description: https://datasheet.ciiva.com/6093/1776114-6093269.pdf?src-supplier=Farnell; ComponentLink2URL: https://datasheet.ciiva.com/7823/kem-c1002-x7r-smd-7823989.pdf?src-supplier=Element14; ComponentLink2Description: https://datasheet.ciiva.com/7823/kem-c1002-x7r-smd-7823989.pdf?src-supplier=Element14; ComponentLink3URL: https://datasheet.ciiva.com/22693/1851736-22693967.pdf?src-supplier=Element14; ComponentLink3Description: https://datasheet.ciiva.com/22693/1851736-22693967.pdf?src-supplier=Element14; ComponentLink4URL: https://datasheet.ciiva.com/14589/70095383-14589402.pdf?src-supplier=Allied+Electronics; ComponentLink4Description: https://datasheet.ciiva.com/14589/70095383-14589402.pdf?src-supplier=Allied+Electronics; ComponentLink5URL: https://datasheet.ciiva.com/14593/70095383-14593978.pdf?src-supplier=Allied+Electronics; ComponentLink5Description: https://datasheet.ciiva.com/14593/70095383-14593978.pdf?src-supplier=Allied+Electronics; ComponentLink6URL: https://datasheet.ciiva.com/5419/kem-c1002-x7r-smd-357932-5419657.pdf?src-supplier=Mouser; ComponentLink6Description: https://datasheet.ciiva.com/5419/kem-c1002-x7r-smd-357932-5419657.pdf?src-supplier=Mouser; ComponentLink7URL: https://datasheet.ciiva.com/18192/getdatasheetpartid-91529-18192711.pdf?src-supplier=Verical; ComponentLink7Description: https://datasheet.ciiva.com/18192/getdatasheetpartid-91529-18192711.pdf?src-supplier=Verical; Voltage Rating (DC): 10V
R1I R2I R3I R4I = 2.2K: SMD Chip Resistor, 2.2 kOhm, ± 1%, 100 mW, 0603 [1608 Metric], Thick Film, General Purpose; Manufacturer: Yageo; Power Rating: 100mW; Temperature Coefficient: 100ppm/°C; Voltage Rating: 50V; Supplier 1: Future Electronics; Manufacturer Part Number: RC0603FR-072K2L; RoHS: Yes; Category: Chip SMD Resistors; Stock 1: 6755000; Pricing 1: 5000=0.0026, 75000=0.001, 100000=0.0024, 200000=0.001, 375000=0.0023, 500000=0.0009, 1250000=0.0022, 5000000=0.002 (USD); Case Code (Imperial): 0603; Case Code (Metric): 1608; Min Operating Temperature: -55°C; Max Operating Temperature: 155°C; Packaging: Tape and Reel; Series: RC; RoHS Compliant: Yes; Lead Free: Lead Free; Supplier Part Number 1: 6372452; Max Power Dissipation: 100mW; Features: Moisture Resistant; Number of Terminations: 2; ComponentLink1URL: https://datasheet.ciiva.com/2453/pyu-r-int-thick-7-2453943.pdf?src-supplier=Digikey; ComponentLink1Description: https://datasheet.ciiva.com/2453/pyu-r-int-thick-7-2453943.pdf?src-supplier=Digikey; ComponentLink2URL: https://datasheet.ciiva.com/2453/pyu-r-int-thick-7-2453944.pdf?src-supplier=Digikey; ComponentLink2Description: https://datasheet.ciiva.com/2453/pyu-r-int-thick-7-2453944.pdf?src-supplier=Digikey; ComponentLink3URL: https://datasheet.ciiva.com/2453/pyu-r-int-thick-7-2453945.pdf?src-supplier=Digikey; ComponentLink3Description: https://datasheet.ciiva.com/2453/pyu-r-int-thick-7-2453945.pdf?src-supplier=Digikey; ComponentLink4URL: https://datasheet.ciiva.com/7660/1868787-7660791.pdf?src-supplier=Element14; ComponentLink4Description: https://datasheet.ciiva.com/7660/1868787-7660791.pdf?src-supplier=Element14; Resistor Type: Thick Film; Resistance Tolerance: 1%; Reach SVHC Compliant: Unknown; ComponentLink5URL: https://datasheet.ciiva.com/46394/443971-46394958.pdf?src-supplier=Element14; ComponentLink5Description: https://datasheet.ciiva.com/46394/443971-46394958.pdf?src-supplier=Element14
U1I = ADUM1252AWA+: Ultra-Low Power, Bidirectional I2C Isolator with Extended VDD, Idle-Bus Hot-Swap and Low VOL; Manufacturer: Analog Devices; Supplier 1: Mouser; Supplier Part Number 1: 584-ADUM1252AWA+; Manufacturer Part Number: ADUM1252AWA+; RoHS: No; Stock 1: 216; Pricing 1: 1=4.29, 10=3.85, 50=3.85, 100=3.15, 1000=2.68, 10000=2.14 (USD)

## Sheet 6_Connector.SchDoc: Connector
size A4; ApprovedBy: Alcatraz; CheckedBy: Alcatraz; Author: Alcatraz; CompanyName: DHNLAB; DrawnBy: Alcatraz; Engineer: Alcatraz; Organization: DHNLAB PVT LTD; Address1: DHANBAD; Address2: JHARKHAND; Address3: INDIA; Address4: ASIA; DocumentNumber: 5; Revision: 1.0; SheetNumber: 5; SheetTotal: 6; ProjectTitle: USB-SMB-ISO-CP2112
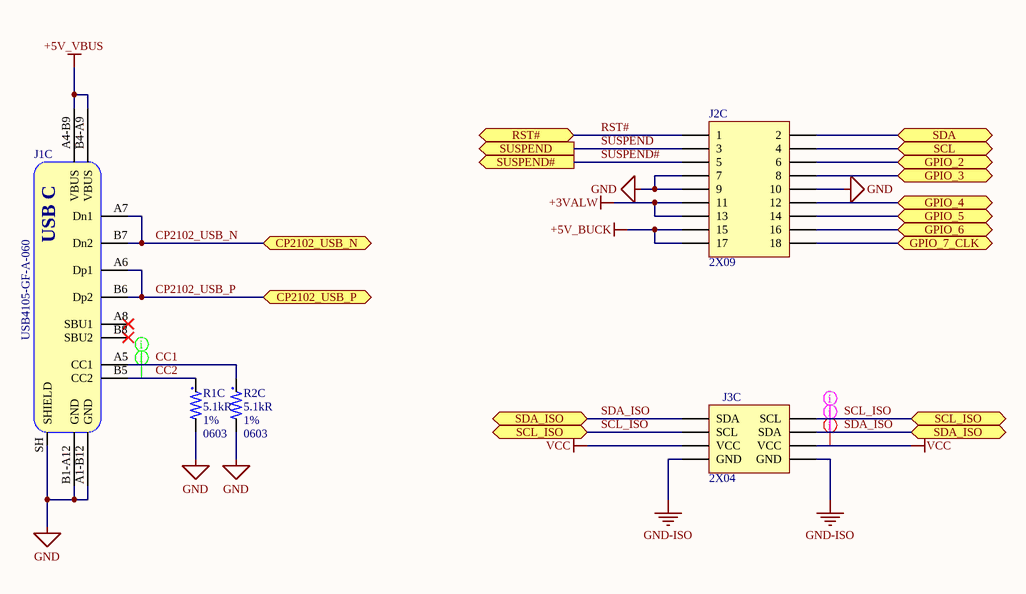
[diagram p4: 6_Connector.SchDoc]

### Parts
J1C  USB4105-GF-A-060  [USB-Type-C-16-Pin-SMT]
J2C  2X09  [PinHeader_2x09_P2.54mm_Vertical]
J3C  2X04  [PinHeader_2x04_P2.54mm_Vertical]
R1C  value 5.1kR  Tolerance: 1%  Case/Package: 0603  [R0603-MFG]  (hidden comment: CRCW06035K10FKEA)
R2C  value 5.1kR  Tolerance: 1%  Case/Package: 0603  [R0603-MFG]  (hidden comment: CRCW06035K10FKEA)

### Ports
CP2102_USB_N (bidir), CP2102_USB_P (bidir), GPIO_2 (bidir), GPIO_3 (bidir), GPIO_4 (bidir), GPIO_5 (bidir), GPIO_6 (bidir), GPIO_7_CLK (bidir), RST# (bidir), SCL (bidir), SCL_ISO (bidir), SDA (bidir), SDA_ISO (bidir), SUSPEND (out), SUSPEND# (out)

### Nets
+3VALW: J2C.11 J2C.13
+5V_BUCK: J2C.15 J2C.17
+5V_VBUS: J1C.A4-B9(VBUS) J1C.B4-A9(VBUS)
GND: J1C.A1-B12(GND) J1C.B1-A12(GND) J1C.SH(SHIELD) J2C.7 J2C.9 J2C.10 R1C.2 R2C.2
GND-ISO: J3C.1(GND) J3C.2(GND)
VCC: J3C.3(VCC) J3C.4(VCC)
CC1: J1C.A5(CC1) R2C.1
CC2: J1C.B5(CC2) R1C.1
CP2102_USB_N: J1C.A7(Dn1) J1C.B7(Dn2) ; port CP2102_USB_N
CP2102_USB_P: J1C.A6(Dp1) J1C.B6(Dp2) ; port CP2102_USB_P
GPIO_2: J2C.6 ; port GPIO_2
GPIO_3: J2C.8 ; port GPIO_3
GPIO_4: J2C.12 ; port GPIO_4
GPIO_5: J2C.14 ; port GPIO_5
GPIO_6: J2C.16 ; port GPIO_6
GPIO_7_CLK: J2C.18 ; port GPIO_7_CLK
RST#: J2C.1 ; port RST#
SCL: J2C.4 ; port SCL
SCL_ISO: J3C.6(SCL) J3C.7(SCL) ; port SCL_ISO
SDA: J2C.2 ; port SDA
SDA_ISO: J3C.5(SDA) J3C.8(SDA) ; port SDA_ISO
SUSPEND: J2C.3 ; port SUSPEND
SUSPEND#: J2C.5 ; port SUSPEND#

Not connected (* = marked no-connect by the designer): J1C A8(SBU1)* B8(SBU2)*

### Layout directives
net class Signal; net class Digital_Signal_Low_Speed: CC1, CC2
net class Power; net class PowerRails_LowVoltage_DC: VCC
net class Signal_50_ohm; net class Digital_Signal_Low_Speed: SCL_ISO, SDA_ISO

### Notes on the sheet
- Title:
- Author:
- Approved:
- Size:
- Date:
- Git Hash:
- A4
- Prj:
- SW Version:
- Variant:
- Edited:
- PUBLIC
- File:
- (in symbol USB-Type-C-16-Pin-SMT) USB C

### Library data of the parts
J1C = USB-Type-C-16-Pin-SMT: USB Connector Type C SMT 16 Pin / (Power pins joints = 12 pins); Manufacturer: GCT; Manufacturer Part Number: USB4105-GF-A-060
J2C = PinHeader 2X09 DU
J3C = I2C_2X04_P2.54mm
R1C R2C = 5.1K: SMD Chip Resistor, 5.1 kOhm, ± 1%, 100 mW, 0603 [1608 Metric], Thick Film, General Purpose; Manufacturer: Vishay; Temperature Coefficient: 100ppm/°C; Max Power Dissipation: 100mW; Voltage Rating: 75V; Supplier 1: Mouser; Manufacturer Part Number: CRCW06035K10FKEA; RoHS: Yes; Category: Chip SMD Resistors; Stock 1: 43654; Pricing 1: 1=0.1, 10=0.034, 50=0.034, 100=0.014, 1000=0.008, 10000=0.004 (USD); Case Code (Imperial): 0603; Case Code (Metric): 1608; Weight: 7.1E-05oz; Contact Plating: Tin; Min Operating Temperature: -55°C; Max Operating Temperature: 155°C; Packaging: Tape and Reel; Series: CRCW; Number of Terminations: 2; Features: Automotive AEC-Q200; Power Rating: 100mW; Voltage Rating (DC): 75V; Package Quantity: 5000; Termination: SMD/SMT; Resistor Type: Thick Film; Construction: Rectangular; Resistance Tolerance: 1%; Technology: THICK FILM; Length: 1.55mm; Width: 0.85mm; Height: 0.45mm; Depth: 0.85mm; Radiation Hardening: No; RoHS Compliant: Yes; Lead Free: 5697LeadFree; Military Standard: Not; Reach SVHC Compliant: Unknown; ComponentLink1URL: https://datasheet.ciiva.com/11809/0900766b80d98afc-11809935.pdf?src-supplier=Rs; ComponentLink1Description: https://datasheet.ciiva.com/11809/0900766b80d98afc-11809935.pdf?src-supplier=Rs; ComponentLink2URL: https://datasheet.ciiva.com/7690/1720486-7690873.pdf?src-supplier=Element14; ComponentLink2Description: https://datasheet.ciiva.com/7690/1720486-7690873.pdf?src-supplier=Element14; ComponentLink3URL: https://datasheet.ciiva.com/15159/getdatasheetpartid-32793-15159338.pdf?src-supplier=Verical; ComponentLink3Description: https://datasheet.ciiva.com/15159/getdatasheetpartid-32793-15159338.pdf?src-supplier=Verical; ComponentLink4URL: https://datasheet.ciiva.com/26314/fld-crcw-e3-data-en-26314742.pdf?src-supplier=Distrelec; ComponentLink4Description: https://datasheet.ciiva.com/26314/fld-crcw-e3-data-en-26314742.pdf?src-supplier=Distrelec; ComponentLink5URL: https://datasheet.ciiva.com/7690/1697337-7690728.pdf?src-supplier=Element14; ComponentLink5Description: https://datasheet.ciiva.com/7690/1697337-7690728.pdf?src-supplier=Element14; ComponentLink6URL: https://datasheet.ciiva.com/3257/dcrcwe3-3257758.pdf?src-supplier=Avnet; ComponentLink6Description: https://datasheet.ciiva.com/3257/dcrcwe3-3257758.pdf?src-supplier=Avnet; ComponentLink7URL: https://datasheet.ciiva.com/16226/dcrcwe3-16226862.pdf?src-supplier=Future+Electronics; ComponentLink7Description: https://datasheet.ciiva.com/16226/dcrcwe3-16226862.pdf?src-supplier=Future+Electronics; Supplier Part Number 1: 71-CRCW0603-5.1K-E3